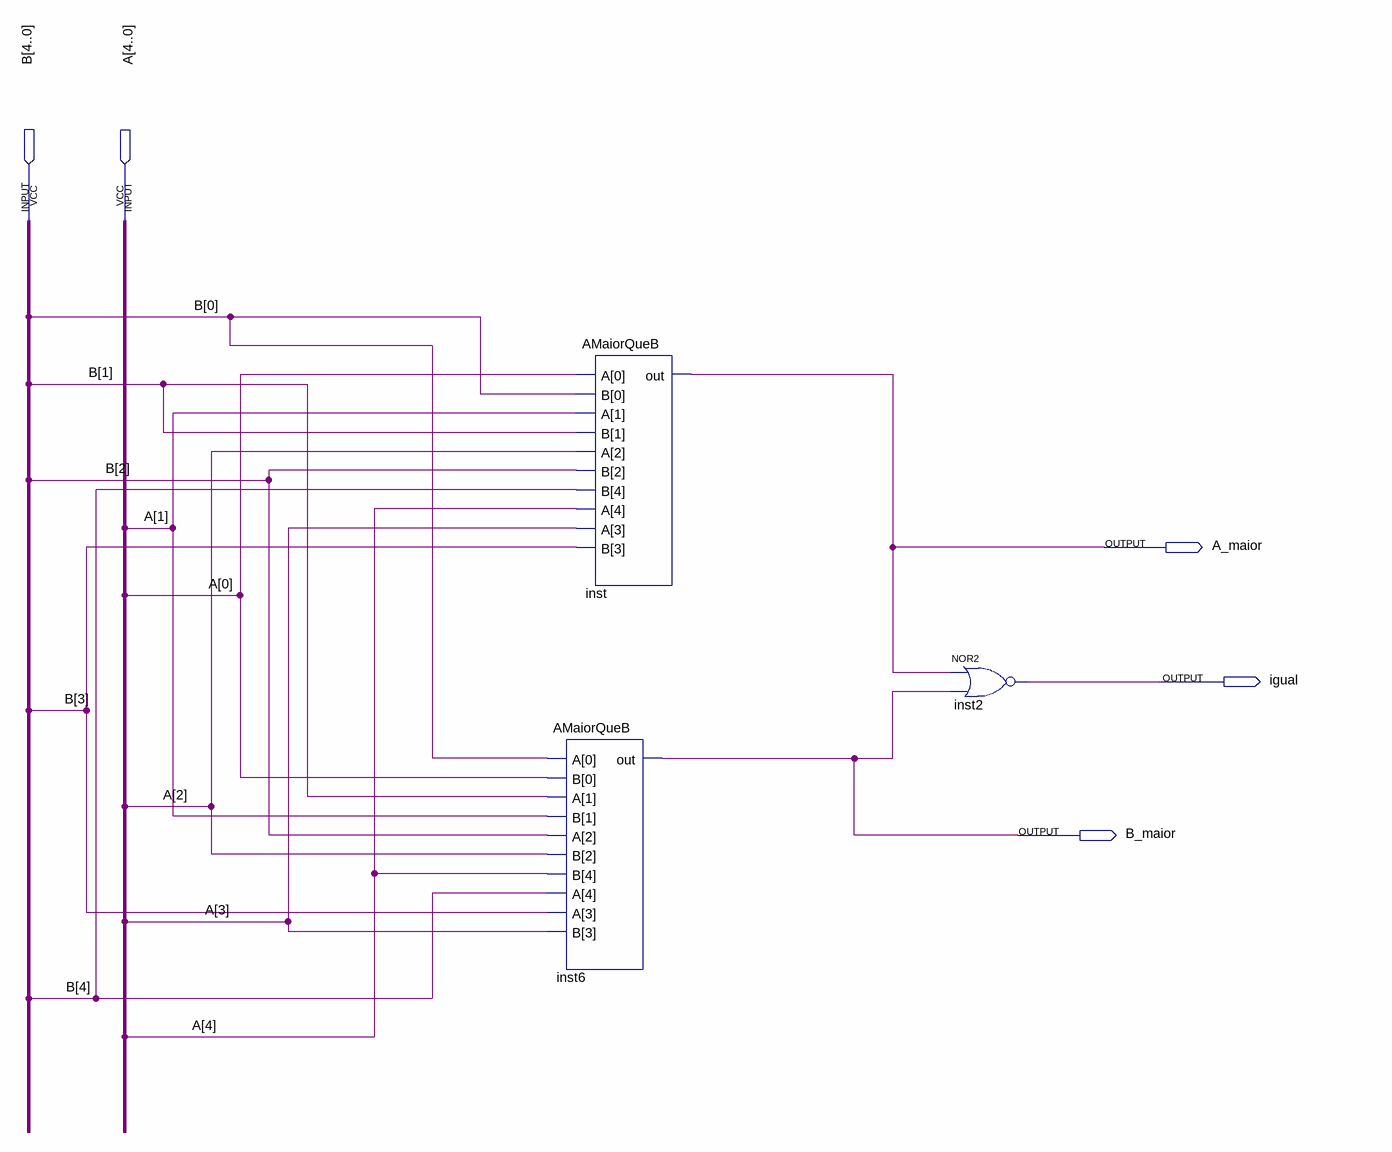
[diagram p0: schematic sheet]
// Quartus schematic Comparadores.bdf as structural Verilog: 3 symbols, 5 pins
module Comparadores (
  input  [4:0] B,
  input  [4:0] A,
  output A_maior,
  output igual,
  output B_maior
);

  AMaiorQueB inst (.A(A), .B(B), .out(A_maior));
  AMaiorQueB inst6 (.A(B), .B(A), .out(B_maior));
  nor inst2 (igual, A_maior, B_maior);
endmodule
